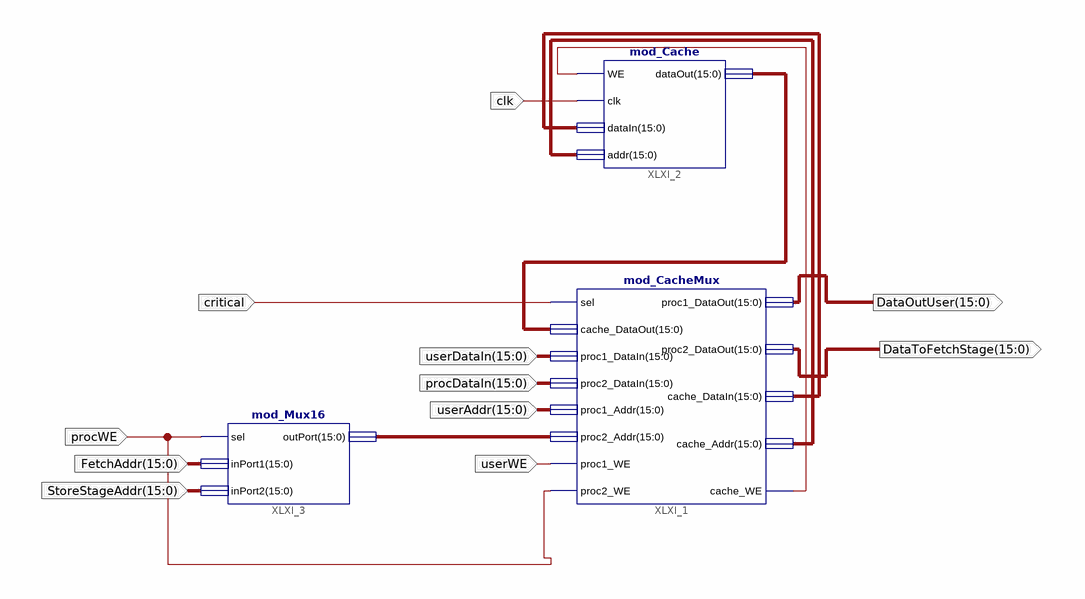
[diagram p0: schematic sheet 1]
// Xilinx ISE schematic mod_LayersUPDATE.sch (spartan3e) as structural Verilog: 3 symbols, 11 ports
module mod_LayersUPDATE (
  input  critical,
  input  [15:0] userDataIn,
  input  [15:0] procDataIn,
  input  [15:0] userAddr,
  input  procWE,
  input  userWE,
  input  [15:0] FetchAddr,
  input  [15:0] StoreStageAddr,
  input  clk,
  output [15:0] DataOutUser,
  output [15:0] DataToFetchStage
);

  wire XLXN_4;
  wire [15:0] XLXN_1, XLXN_2, XLXN_3, XLXN_7;

  mod_CacheMux XLXI_1 (
    .sel(critical), .cache_DataOut(XLXN_1), .proc1_DataIn(userDataIn), .proc2_DataIn(procDataIn),
    .proc1_Addr(userAddr), .proc2_Addr(XLXN_7), .proc1_WE(userWE), .proc2_WE(procWE),
    .proc1_DataOut(DataOutUser), .proc2_DataOut(DataToFetchStage), .cache_DataIn(XLXN_2),
    .cache_Addr(XLXN_3), .cache_WE(XLXN_4));
  mod_Cache XLXI_2 (.WE(XLXN_4), .clk(clk), .dataIn(XLXN_2), .addr(XLXN_3), .dataOut(XLXN_1));
  mod_Mux16 XLXI_3 (.sel(procWE), .inPort1(FetchAddr), .inPort2(StoreStageAddr), .outPort(XLXN_7));
endmodule
